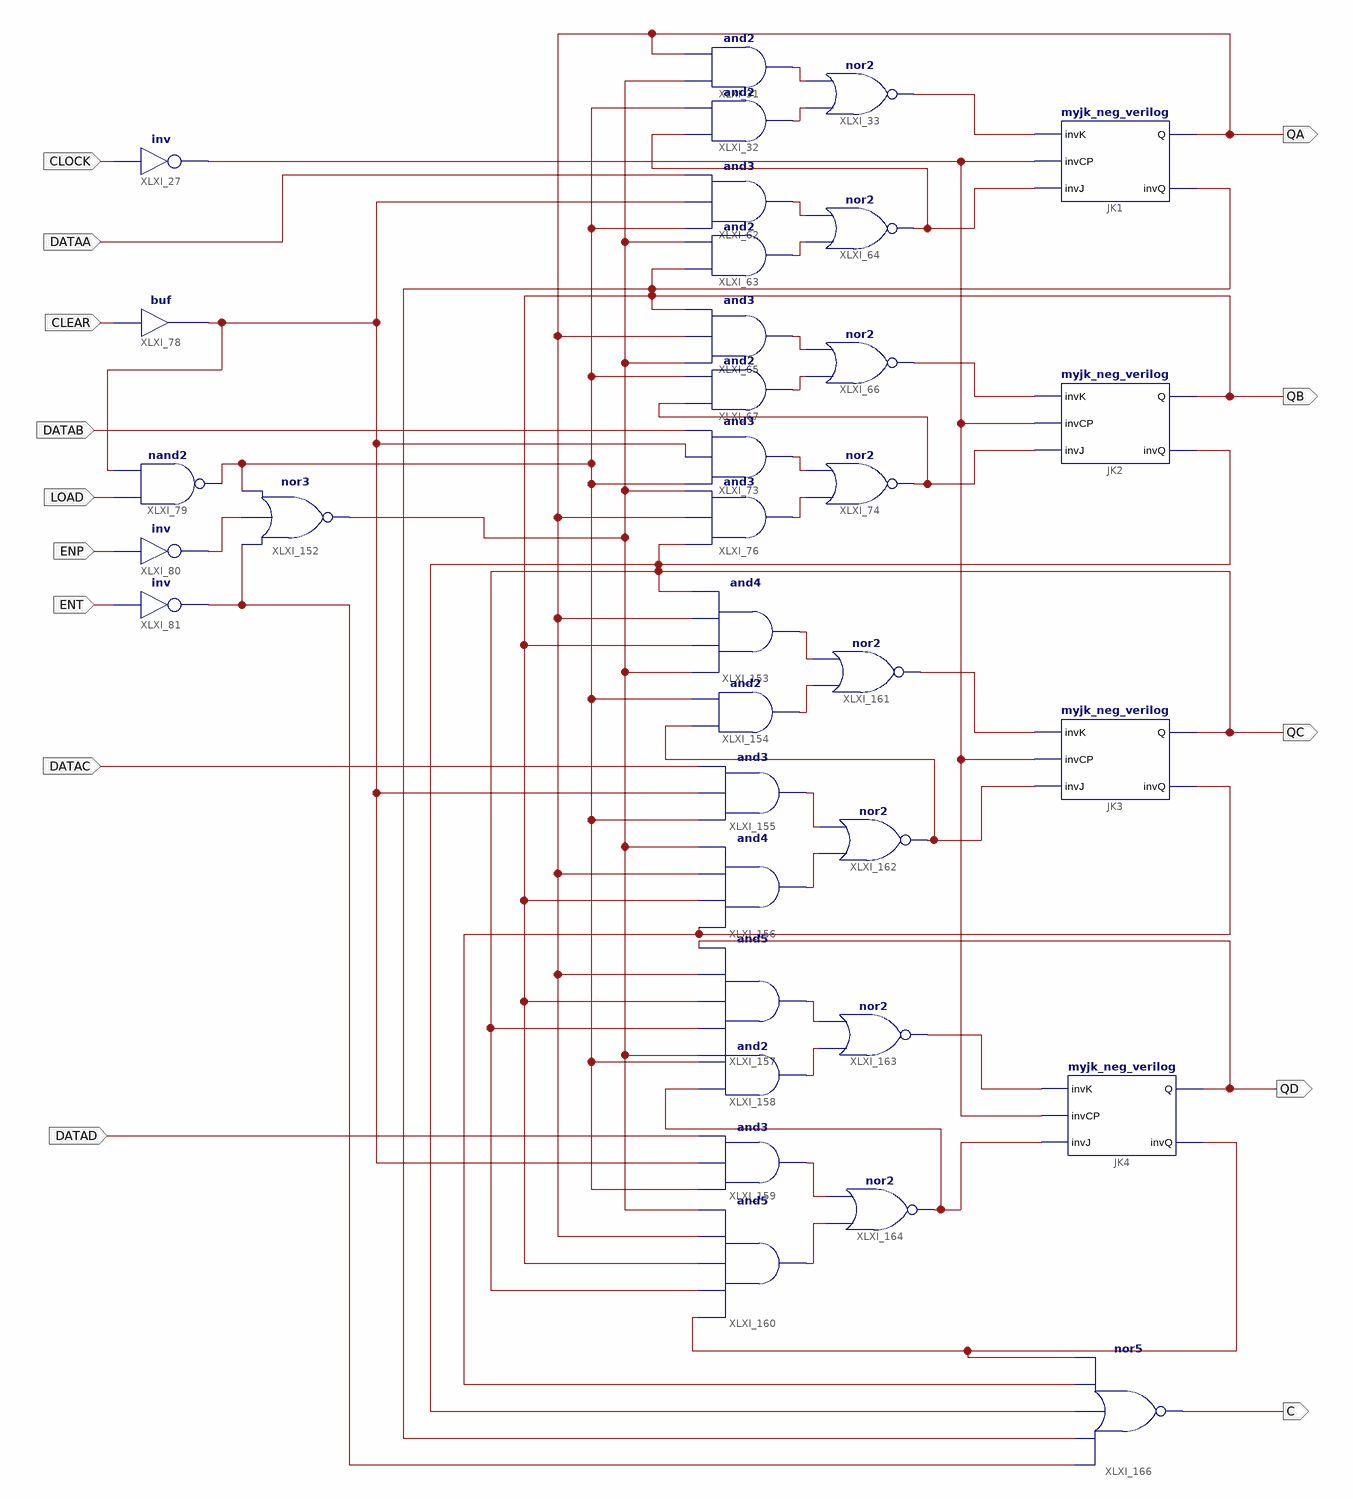
[diagram p0: schematic sheet 1]
// Xilinx ISE schematic my163.sch (spartan3e) as structural Verilog: 35 symbols, 14 ports
module my163 (
  input  CLOCK,
  input  DATAB,
  input  LOAD,
  input  CLEAR,
  input  ENP,
  input  ENT,
  input  DATAA,
  input  DATAC,
  input  DATAD,
  output QC,
  output QA,
  output QB,
  output QD,
  output C
);

  wire XLXN_4, XLXN_7, XLXN_9, XLXN_18, XLXN_19, XLXN_20, XLXN_22, XLXN_23, XLXN_24, XLXN_29, XLXN_32,
       XLXN_33, XLXN_35, XLXN_38, XLXN_46, XLXN_55, XLXN_277, XLXN_278, XLXN_279, XLXN_281, XLXN_284,
       XLXN_285, XLXN_287, XLXN_288, XLXN_289, XLXN_290, XLXN_291, XLXN_295, XLXN_301, XLXN_302, XLXN_307,
       XLXN_316, XLXN_317, XLXN_318;

  not XLXI_27 (XLXN_4, CLOCK);
  nand XLXI_79 (XLXN_277, LOAD, XLXN_55);
  buf XLXI_78 (XLXN_55, CLEAR);
  not XLXI_80 (XLXN_278, ENP);
  not XLXI_81 (XLXN_279, ENT);
  myjk_neg_verilog JK1 (.invK(XLXN_18), .invCP(XLXN_4), .invJ(XLXN_22), .Q(QA), .invQ(XLXN_29));
  and XLXI_31 (XLXN_7, XLXN_281, QA);
  nor XLXI_33 (XLXN_18, XLXN_9, XLXN_7);
  and XLXI_32 (XLXN_9, XLXN_22, XLXN_277);
  and XLXI_62 (XLXN_19, XLXN_277, XLXN_55, DATAA);
  nor XLXI_64 (XLXN_22, XLXN_20, XLXN_19);
  and XLXI_63 (XLXN_20, XLXN_29, XLXN_281);
  and XLXI_65 (XLXN_23, XLXN_281, QA, QB);
  nor XLXI_66 (XLXN_32, XLXN_24, XLXN_23);
  and XLXI_67 (XLXN_24, XLXN_38, XLXN_277);
  nor XLXI_74 (XLXN_38, XLXN_35, XLXN_33);
  and XLXI_73 (XLXN_33, XLXN_277, XLXN_55, DATAB);
  and XLXI_76 (XLXN_35, XLXN_46, QA, XLXN_281);
  myjk_neg_verilog JK2 (.invK(XLXN_32), .invCP(XLXN_4), .invJ(XLXN_38), .Q(QB), .invQ(XLXN_46));
  myjk_neg_verilog JK3 (.invK(XLXN_291), .invCP(XLXN_4), .invJ(XLXN_295), .Q(QC), .invQ(XLXN_301));
  nor XLXI_152 (XLXN_281, XLXN_279, XLXN_278, XLXN_277);
  and XLXI_153 (XLXN_284, XLXN_281, QB, QA, QC);
  and XLXI_154 (XLXN_285, XLXN_295, XLXN_277);
  and XLXI_155 (XLXN_287, XLXN_277, XLXN_55, DATAC);
  and XLXI_156 (XLXN_288, XLXN_301, QB, QA, XLXN_281);
  and XLXI_157 (XLXN_289, XLXN_281, QC, QB, QA, QD);
  and XLXI_158 (XLXN_290, XLXN_318, XLXN_277);
  and XLXI_159 (XLXN_316, XLXN_277, XLXN_55, DATAD);
  and XLXI_160 (XLXN_317, XLXN_307, QC, QB, QA, XLXN_281);
  nor XLXI_161 (XLXN_291, XLXN_285, XLXN_284);
  nor XLXI_162 (XLXN_295, XLXN_288, XLXN_287);
  nor XLXI_163 (XLXN_302, XLXN_290, XLXN_289);
  nor XLXI_164 (XLXN_318, XLXN_317, XLXN_316);
  myjk_neg_verilog JK4 (.invK(XLXN_302), .invCP(XLXN_4), .invJ(XLXN_318), .Q(QD), .invQ(XLXN_307));
  nor XLXI_166 (C, XLXN_279, XLXN_29, XLXN_46, XLXN_301, XLXN_307);
endmodule
